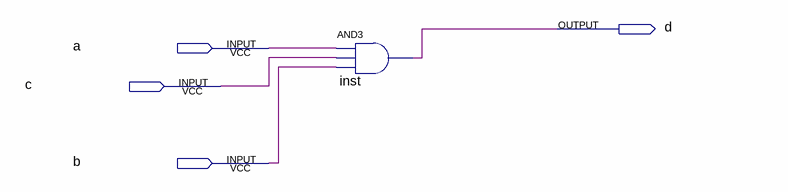
[diagram p0: schematic sheet]
// Quartus schematic test.bdf as structural Verilog: 1 symbols, 4 pins
module test (
  input  a,
  input  c,
  input  b,
  output d
);

  and inst (d, a, c, b);
endmodule
